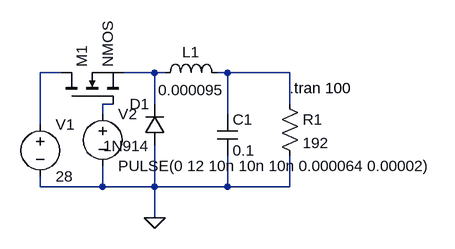
[diagram p0: schematic Buck.asc]
Buck.asc, the LTspice schematic file:
Version 4.1
SHEET 1 880 680
WIRE 48 48 16 48
WIRE 192 48 144 48
WIRE 208 48 192 48
WIRE 304 48 288 48
WIRE 400 48 304 48
WIRE 128 96 112 96
WIRE 192 96 192 48
WIRE 400 96 400 48
WIRE 112 112 112 96
WIRE 304 112 304 48
WIRE 16 128 16 48
WIRE 16 224 16 208
WIRE 112 224 112 192
WIRE 112 224 16 224
WIRE 192 224 192 160
WIRE 192 224 112 224
WIRE 304 224 304 176
WIRE 304 224 192 224
WIRE 400 224 400 176
WIRE 400 224 304 224
WIRE 192 272 192 224
FLAG 192 272 0
SYMBOL voltage 16 112 R0
WINDOW 123 0 0 Left 0
WINDOW 39 0 0 Left 0
SYMATTR InstName V1
SYMATTR Value 28
SYMBOL nmos 48 96 R270
SYMATTR InstName M1
SYMBOL ind 192 64 R270
WINDOW 0 32 56 VTop 2
WINDOW 3 5 56 VBottom 2
SYMATTR InstName L1
SYMATTR Value 0.000095
SYMATTR SpiceLine Ipk=1.2
SYMBOL cap 288 112 R0
SYMATTR InstName C1
SYMATTR Value 0.1
SYMBOL res 384 80 R0
SYMATTR InstName R1
SYMATTR Value 192
SYMBOL voltage 112 96 R0
WINDOW 123 0 0 Left 0
WINDOW 39 0 0 Left 0
SYMATTR InstName V2
SYMATTR Value PULSE(0 12 10n 10n 10n 0.000064 0.00002)
SYMBOL diode 208 160 R180
WINDOW 0 24 64 Left 2
WINDOW 3 24 -1 Left 2
SYMATTR InstName D1
SYMATTR Value 1N914
TEXT 400 72 Left 2 !.tran 100

The netlist it stands for:
* Buck.asc
V1 N001 0 28
M1 N001 N004 N002 N002 NMOS
L1 N002 N003 0.000095 Ipk=1.2
C1 N003 0 0.1
R1 N003 0 192
V2 N004 0 PULSE(0 12 10n 10n 10n 0.000064 0.00002)
D1 0 N002 1N914
.model D D
.lib standard.dio
.model NMOS NMOS
.model PMOS PMOS
.lib standard.mos
.tran 100
.backanno
.end